# EasyEDA Pro project ProPrj_Motorcycle Controller_2026-08-31.epro

# Schematic Moto-Ctrl
Board Name: Board1; Create Date: 2026-07-16; Page Name: P1; Project Name: Motorcycle Controller; Schematic Name: Schematic3; Update Date: 2026-07-16; Company: EasyEDA.com; Page Size: A4; Version: V0.1
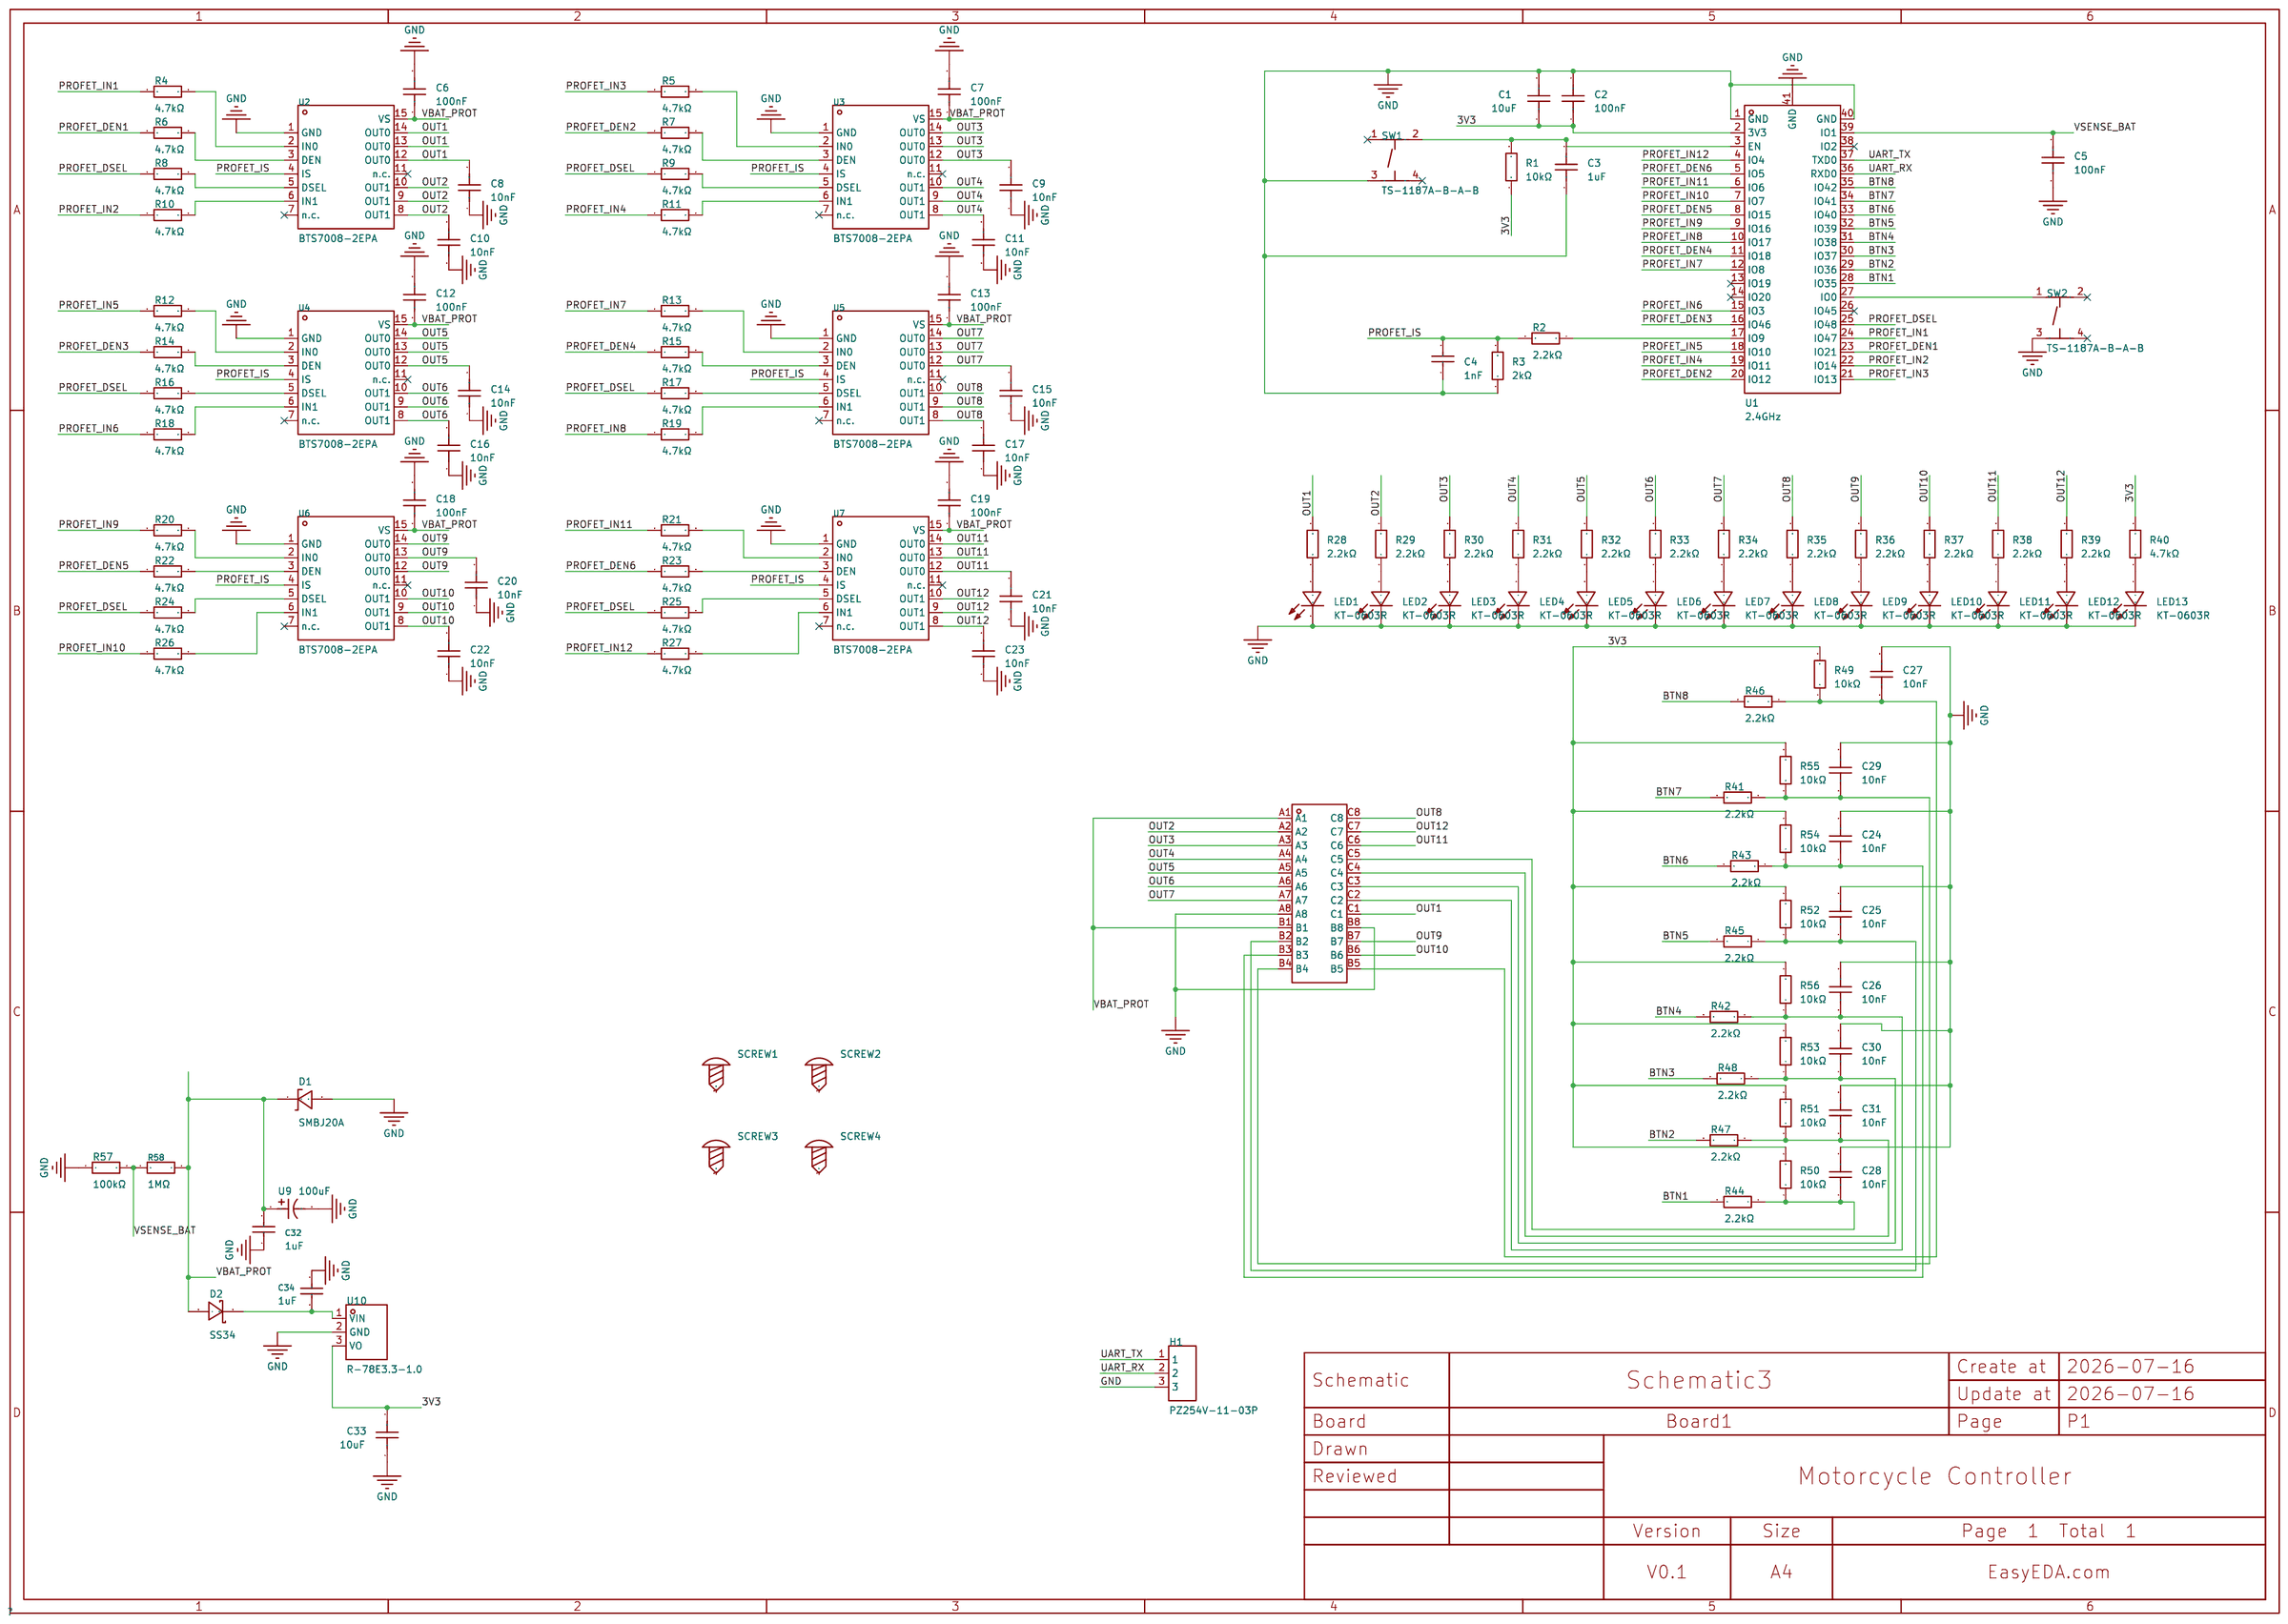
[diagram p0: schematic sheet]

## Parts
C1  10uF  [C0603]
C2  100nF  [C0402]
C3  1uF  [C0402]
C4  1nF  [C0402]
C5  100nF  [C0402]
C6  100nF  [C0603]
C7  100nF  [C0603]
C8  10nF  [C0603]
C9  10nF  [C0603]
C10  10nF  [C0603]
C11  10nF  [C0603]
C12  100nF  [C0603]
C13  100nF  [C0603]
C14  10nF  [C0603]
C15  10nF  [C0603]
C16  10nF  [C0603]
C17  10nF  [C0603]
C18  100nF  [C0603]
C19  100nF  [C0603]
C20  10nF  [C0603]
C21  10nF  [C0603]
C22  10nF  [C0603]
C23  10nF  [C0603]
C24  10nF  [C0603]
C25  10nF  [C0603]
C26  10nF  [C0603]
C27  10nF  [C0603]
C28  10nF  [C0603]
C29  10nF  [C0603]
C30  10nF  [C0603]
C31  10nF  [C0603]
C32  1uF  [C0805]
C33  10uF  [C0603]
C34  1uF  [C0805]
CN3  HCCPHPE24BKA90F  [CONN-TH_HCCPHPE24BKA90F]
D1  SMBJ20A  [SMB_L4.6-W3.6-LS5.3-RD]
D2  SS34  [SMA_L4.3-W2.6-LS5.2-RD]
H1  PZ254V-11-03P  [HDR-TH_3P-P2.54-V-M_PZ254V-11-03P]
LED1  KT-0603R  [LED-SMD_L1.6-W0.8-R-RD]
LED2  KT-0603R  [LED-SMD_L1.6-W0.8-R-RD]
LED3  KT-0603R  [LED-SMD_L1.6-W0.8-R-RD]
LED4  KT-0603R  [LED-SMD_L1.6-W0.8-R-RD]
LED5  KT-0603R  [LED-SMD_L1.6-W0.8-R-RD]
LED6  KT-0603R  [LED-SMD_L1.6-W0.8-R-RD]
LED7  KT-0603R  [LED-SMD_L1.6-W0.8-R-RD]
LED8  KT-0603R  [LED-SMD_L1.6-W0.8-R-RD]
LED9  KT-0603R  [LED-SMD_L1.6-W0.8-R-RD]
LED10  KT-0603R  [LED-SMD_L1.6-W0.8-R-RD]
LED11  KT-0603R  [LED-SMD_L1.6-W0.8-R-RD]
LED12  KT-0603R  [LED-SMD_L1.6-W0.8-R-RD]
LED13  KT-0603R  [LED-SMD_L1.6-W0.8-R-RD]
R1  10kΩ  [R0402]
R2  2.2kΩ  [R0603]
R3  2kΩ  [R0603]
R4  4.7kΩ  [R0603]
R5  4.7kΩ  [R0603]
R6  4.7kΩ  [R0603]
R7  4.7kΩ  [R0603]
R8  4.7kΩ  [R0603]
R9  4.7kΩ  [R0603]
R10  4.7kΩ  [R0603]
R11  4.7kΩ  [R0603]
R12  4.7kΩ  [R0603]
R13  4.7kΩ  [R0603]
R14  4.7kΩ  [R0603]
R15  4.7kΩ  [R0603]
R16  4.7kΩ  [R0603]
R17  4.7kΩ  [R0603]
R18  4.7kΩ  [R0603]
R19  4.7kΩ  [R0603]
R20  4.7kΩ  [R0603]
R21  4.7kΩ  [R0603]
R22  4.7kΩ  [R0603]
R23  4.7kΩ  [R0603]
R24  4.7kΩ  [R0603]
R25  4.7kΩ  [R0603]
R26  4.7kΩ  [R0603]
R27  4.7kΩ  [R0603]
R28  2.2kΩ  [R0603]
R29  2.2kΩ  [R0603]
R30  2.2kΩ  [R0603]
R31  2.2kΩ  [R0603]
R32  2.2kΩ  [R0603]
R33  2.2kΩ  [R0603]
R34  2.2kΩ  [R0603]
R35  2.2kΩ  [R0603]
R36  2.2kΩ  [R0603]
R37  2.2kΩ  [R0603]
R38  2.2kΩ  [R0603]
R39  2.2kΩ  [R0603]
R40  4.7kΩ  [R0603]
R41  2.2kΩ  [R0603]
R42  2.2kΩ  [R0603]
R43  2.2kΩ  [R0603]
R44  2.2kΩ  [R0603]
R45  2.2kΩ  [R0603]
R46  2.2kΩ  [R0603]
R47  2.2kΩ  [R0603]
R48  2.2kΩ  [R0603]
R49  10kΩ  [R0402]
R50  10kΩ  [R0402]
R51  10kΩ  [R0402]
R52  10kΩ  [R0402]
R53  10kΩ  [R0402]
R54  10kΩ  [R0402]
R55  10kΩ  [R0402]
R56  10kΩ  [R0402]
R57  100kΩ  [R0603]
R58  1MΩ  [R0603]
SCREW1  -  [Screw-Hole-M3]
SCREW2  -  [Screw-Hole-M3]
SCREW3  -  [Screw-Hole-M3]
SCREW4  -  [Screw-Hole-M3]
SW1  TS-1187A-B-A-B  [SW-SMD_4P-L5.1-W5.1-P3.70-LS6.5-TL_H1.5]
SW2  TS-1187A-B-A-B  [SW-SMD_4P-L5.1-W5.1-P3.70-LS6.5-TL_H1.5]
U1  2.4GHz  [WIFIM-SMD_ESP32-S3-WROOM-1-N8]
U2  BTS7008-2EPA  [PG-TSDSO-14_L4.9-W3.9-P0.65-LS6.0-BL-EP]
U3  BTS7008-2EPA  [PG-TSDSO-14_L4.9-W3.9-P0.65-LS6.0-BL-EP]
U4  BTS7008-2EPA  [PG-TSDSO-14_L4.9-W3.9-P0.65-LS6.0-BL-EP]
U5  BTS7008-2EPA  [PG-TSDSO-14_L4.9-W3.9-P0.65-LS6.0-BL-EP]
U6  BTS7008-2EPA  [PG-TSDSO-14_L4.9-W3.9-P0.65-LS6.0-BL-EP]
U7  BTS7008-2EPA  [PG-TSDSO-14_L4.9-W3.9-P0.65-LS6.0-BL-EP]
U9  100uF  [CAP-SMD_BD8.0-L8.3-W8.3-LS9.1-FD]
U10  R-78E3.3-1.0  [PWRM-TH_R-78EXX-1.0]

## Library data of the parts
C1 C33 = CL10A106KP8NNNC: Capacitance:10uF Tolerance:±10% Tolerance:±10% Voltage Rating:10V Temperature Coefficient:X5R; LCSC Part Name: 10uF ±10% 10V; Supplier Part: C19702; Manufacturer: SAMSUNG(三星); Supplier Footprint: 0603; JLCPCB Part Class: Basic Part; Datasheet: https://item.szlcsc.com/datasheet/CL10A106KP8NNNC/20411.html; Supplier: LCSC; Tolerance: ±10%; Voltage Rating: 10V; Temperature Coefficient: X5R
C2 C5 = CL05B104KO5NNNC: Capacitance:100nF Tolerance:±10% Tolerance:±10% Voltage Rating:16V Temperature Coefficient:X7R; LCSC Part Name: 100nF ±10% 16V; Supplier Part: C1525; Manufacturer: SAMSUNG(三星); Supplier Footprint: 0402; JLCPCB Part Class: Basic Part; Datasheet: https://item.szlcsc.com/datasheet/CL05B104KO5NNNC/1877.html; Supplier: LCSC; Tolerance: ±10%; Voltage Rating: 16V; Temperature Coefficient: X7R
C3 = CL05A105KA5NQNC: Capacitance:1uF Tolerance:±10% Tolerance:±10% Voltage Rating:25V Temperature Coefficient:X5R; LCSC Part Name: 1uF ±10% 25V; Supplier Part: C52923; Manufacturer: SAMSUNG(三星); Supplier Footprint: 0402; JLCPCB Part Class: Basic Part; Datasheet: https://item.szlcsc.com/datasheet/CL05A105KA5NQNC/53938.html; Supplier: LCSC; Tolerance: ±10%; Voltage Rating: 25V; Temperature Coefficient: X5R
C4 = 0402B102K500NT: Capacitance:1nF Tolerance:±10% Tolerance:±10% Voltage Rating:50V Temperature Coefficient:X7R; LCSC Part Name: 1nF ±10% 50V; Supplier Part: C1523; Manufacturer: FH(风华); Supplier Footprint: 0402; JLCPCB Part Class: Basic Part; Datasheet: https://item.szlcsc.com/datasheet/0402B102K500NT/1875.html; Supplier: LCSC; Tolerance: ±10%; Voltage Rating: 50V; Temperature Coefficient: X7R
C6 C7 C12 C13 C18 C19 = CC0603KRX7R9BB104: Capacitance:100nF Tolerance:±10% Tolerance:±10% Voltage Rating:50V Temperature Coefficient:X7R; LCSC Part Name: 100nF ±10% 50V; Supplier Part: C14663; Manufacturer: YAGEO(国巨); Supplier Footprint: 0603; JLCPCB Part Class: Basic Part; Datasheet: https://item.szlcsc.com/datasheet/CC0603KRX7R9BB104/15331.html; Supplier: LCSC; Tolerance: ±10%; Voltage Rating: 50V; Temperature Coefficient: X7R
C8-C11 C14-C17 C20-C31 = 0603B103K500NT: Capacitance:10nF Tolerance:±10% Tolerance:±10% Voltage Rating:50V Temperature Coefficient:X7R; LCSC Part Name: 10nF ±10% 50V; Supplier Part: C57112; Manufacturer: FH(风华); Supplier Footprint: 0603; JLCPCB Part Class: Basic Part; Datasheet: https://item.szlcsc.com/datasheet/0603B103K500NT/58143.html; Supplier: LCSC; Tolerance: ±10%; Voltage Rating: 50V; Temperature Coefficient: X7R
C32 C34 = CL21B105KBFNNNE: Capacitance:1uF Tolerance:±10% Tolerance:±10% Voltage Rating:50V Temperature Coefficient:X7R; LCSC Part Name: 1uF ±10% 50V; Supplier Part: C28323; Manufacturer: SAMSUNG(三星); Supplier Footprint: 0805; JLCPCB Part Class: Basic Part; Datasheet: https://item.szlcsc.com/datasheet/CL21B105KBFNNNE/29074.html; Supplier: LCSC; Tolerance: ±10%; Voltage Rating: 50V; Temperature Coefficient: X7R
CN3 = HCCPHPE24BKA90F_C5349068: Supplier Part: C5349068; Manufacturer: Aptiv(Delphi); Supplier Footprint: 弯插; JLCPCB Part Class: Extended Part; Datasheet: https://item.szlcsc.com/datasheet/HCCPHPE24BKA90F/6133049.html; Supplier: LCSC
D1 = SMBJ20A_C364296: polarity:Bidirectional Reverse Stand-Off Voltage (Vrwm):20V Maximum Clamping Voltage:32.4V Peak Pulse Current (Ipp):18.6A Peak Pulse Power Dissipation (Ppp):600W Breakdown Voltage:24.5V Reverse Leakage Current (Ir):1uA Operating Temperature:-65℃~+150℃ Ope; LCSC Part Name: 单向TVS 20V截止 18.6A峰值脉冲; Supplier Part: C364296; Manufacturer: MDD(辰达半导体); Supplier Footprint: DO-214AA(SMB); JLCPCB Part Class: Extended Part; Datasheet: https://atta.szlcsc.com/upload/public/pdf/source/20240729/4651DBAA3EEC8A2972CE75AE0A6D3452.pdf; Supplier: LCSC; polarity: Bidirectional; Reverse Stand-Off Voltage (Vrwm): 20V; Maximum Clamping Voltage: 32.4V; Peak Pulse Current (Ipp): 18.6A; Peak Pulse Power Dissipation (Ppp): 600W; Breakdown Voltage: 24.5V; Reverse Leakage Current (Ir): 1uA; Operating Temperature: -65℃~+150℃; Type: TVS
D2 = SS34_C8678: Diode Configuration:Independent Voltage - Forward(Vf@If):550mV@3A Voltage - DC Reverse(Vr):40V Current - Rectified:3A Reverse Leakage Current (Ir):500uA@40V Operating Junction Temperature Range:-55℃~+125℃ Operating Junction Temperature Range:-55℃~+125℃; LCSC Part Name: 电压:40V 电流:3A; Supplier Part: C8678; Manufacturer: MDD(辰达半导体); Supplier Footprint: SMA(DO-214AC); JLCPCB Part Class: Basic Part; Datasheet: https://item.szlcsc.com/datasheet/SS34/9178.html; Supplier: LCSC; Diode Configuration: Independent; Voltage - Forward(Vf@If): 550mV@3A; Voltage - DC Reverse(Vr): 40V; Current - Rectified: 3A; Reverse Leakage Current (Ir): 500uA@40V; Operating Junction Temperature Range: -55℃~+125℃
H1 = PZ254V-11-03P: Pin Structure:1x3P Pitch:2.54mm Row Spacing:- Circluar Pins/Square Pins:Pin Header Mounting Type:Through Hole Number of Rows:1 Number of Pins:3P Current Rating:3A Voltage Rating (Max):250V Length of Mating Pin:6mm Insulation Height:2.5mm Length of End Con; LCSC Part Name: 1x3P 间距:2.54mm 方针 直插; Supplier Part: C2937625; Manufacturer: XFCN(兴飞); Supplier Footprint: 插件,P=2.54mm; JLCPCB Part Class: Extended Part; Datasheet: https://item.szlcsc.com/datasheet/PZ254V-11-03P/3293280.html; Supplier: LCSC; Pin Structure: 1x3P; Pitch: 2.54mm; Circluar Pins/Square Pins: Pin Header; Mounting Type: Through Hole; Number of Rows: 1; Number of Pins: 3P; Current Rating: 3A; Voltage Rating (Max): 250V; Length of Mating Pin: 6mm; Insulation Height: 2.5mm; Length of End Connection Pin: 3mm; Operating Temperature: -40℃~+105℃; Color: Black
LED1-LED13 = KT-0603R: Lamp Holder Type:1.6mm x 0.8mm square LED Illumination Color:Red Voltage - Forward(Vf):1.8V~2.4V Voltage - Forward(Vf):1.8V~2.4V Power(Watts):40mW Forward Current:20mA Wavelength - Dominant:615nm~630nm Wavelength - Dominant:615nm~630nm Peak Wavelength:645; LCSC Part Name: 0603 红灯 高亮; Supplier Part: C2286; Manufacturer: KENTO; Supplier Footprint: 0603; JLCPCB Part Class: Basic Part; Datasheet: https://item.szlcsc.com/datasheet/KT-0603R/2659.html; Supplier: LCSC; Lamp Holder Type: 1.6mm x 0.8mm square LED; Illumination Color: Red; Voltage - Forward(Vf): 1.8V~2.4V; Power(Watts): 40mW; Forward Current: 20mA; Wavelength - Dominant: 615nm~630nm; Peak Wavelength: 645nm; Diode Configuration: Discrete Diode; Lens Color: Water Clear; Luminous Intensity: 300mcd; Viewing Angle: 120°; Operating Temperature: -40℃~+85℃
R1 R49-R56 = RC0402FR-0710KL: Type:Thick Film Resistor Resistance:10kΩ Tolerance:±1% Tolerance:±1% Power(Watts):62.5mW Voltage-Supply(Max):50V Temperature Coefficient:±100ppm/℃ Temperature Coefficient:±100ppm/℃ Operating Temperature:-55℃~+155℃ Operating Temperature:-55℃~+155℃; LCSC Part Name: 厚膜电阻 10kΩ ±1% 62.5mW; Supplier Part: C60490; Manufacturer: YAGEO(国巨); Supplier Footprint: 0402; JLCPCB Part Class: Extended Part; Datasheet: https://item.szlcsc.com/datasheet/RC0402FR-0710KL/61542.html; Supplier: LCSC; Type: Thick Film Resistor; Tolerance: ±1%; Power(Watts): 62.5mW; Voltage-Supply(Max): 50V; Temperature Coefficient: ±100ppm/℃; Operating Temperature: -55℃~+155℃
R2 R28-R39 R41-R48 = 0603WAF2201T5E_C4190: Type:Thick Film Resistors Resistance:2.2kΩ Tolerance:±1% Tolerance:±1% Power(Watts): Overload Voltage (Max): Temperature Coefficient:±100ppm/℃ Temperature Coefficient:±100ppm/℃ Operating Temperature Range:-55℃~+155℃ Operating Temperature Range:-55℃~+155℃; LCSC Part Name: 2.2kΩ ±1% 100mW 厚膜电阻; Supplier Part: C4190; Manufacturer: UNI-ROYAL(厚声); Manufacturer Part: 0603WAF2201T5E; Supplier Footprint: 0603; JLCPCB Part Class: Basic Part; Datasheet: https://atta.szlcsc.com/upload/public/pdf/source/20200306/C422600_1E6D84923E4A46A82E41ADD87F860B5C.pdf; Supplier: LCSC; Type: Thick Film Resistors; Tolerance: ±1%; Temperature Coefficient: ±100ppm/℃; Operating Temperature Range: -55℃~+155℃
R3 = 0603WAF2001T5E: Type:Thick Film Resistor Resistance:2kΩ Tolerance:±1% Tolerance:±1% Power(Watts):100mW Voltage-Supply(Max):75V Temperature Coefficient:±100ppm/℃ Temperature Coefficient:±100ppm/℃ Operating Temperature:-55℃~+155℃ Operating Temperature:-55℃~+155℃; LCSC Part Name: 2kΩ ±1% 100mW 厚膜电阻; Supplier Part: C22975; Manufacturer: UNI-ROYAL(厚声); Supplier Footprint: 0603; JLCPCB Part Class: Basic Part; Datasheet: https://item.szlcsc.com/datasheet/0603WAF2001T5E/23702.html; Supplier: LCSC; Type: Thick Film Resistor; Tolerance: ±1%; Power(Watts): 100mW; Voltage-Supply(Max): 75V; Temperature Coefficient: ±100ppm/℃; Operating Temperature: -55℃~+155℃
R4-R27 R40 = 0603WAF4701T5E: Type:Thick Film Resistor Resistance:4.7kΩ Tolerance:±1% Tolerance:±1% Power(Watts):100mW Voltage-Supply(Max):75V Temperature Coefficient:±100ppm/℃ Temperature Coefficient:±100ppm/℃ Operating Temperature:-55℃~+155℃ Operating Temperature:-55℃~+155℃; LCSC Part Name: 4.7kΩ ±1% 100mW 厚膜电阻; Supplier Part: C23162; Manufacturer: UNI-ROYAL(厚声); Supplier Footprint: 0603; JLCPCB Part Class: Basic Part; Datasheet: https://item.szlcsc.com/datasheet/0603WAF4701T5E/23889.html; Supplier: LCSC; Type: Thick Film Resistor; Tolerance: ±1%; Power(Watts): 100mW; Voltage-Supply(Max): 75V; Temperature Coefficient: ±100ppm/℃; Operating Temperature: -55℃~+155℃
R57 = 0603WAF1003T5E: Type:Thick Film Resistor Resistance:100kΩ Tolerance:±1% Tolerance:±1% Power(Watts):100mW Voltage-Supply(Max):75V Temperature Coefficient:±100ppm/℃ Temperature Coefficient:±100ppm/℃ Operating Temperature:-55℃~+155℃ Operating Temperature:-55℃~+155℃; LCSC Part Name: 100kΩ ±1% 100mW 厚膜电阻; Supplier Part: C25803; Manufacturer: UNI-ROYAL(厚声); Supplier Footprint: 0603; JLCPCB Part Class: Basic Part; Datasheet: https://item.szlcsc.com/datasheet/0603WAF1003T5E/26546.html; Supplier: LCSC; Type: Thick Film Resistor; Tolerance: ±1%; Power(Watts): 100mW; Voltage-Supply(Max): 75V; Temperature Coefficient: ±100ppm/℃; Operating Temperature: -55℃~+155℃
R58 = 0603WAF1004T5E: Type:Thick Film Resistor Resistance:1MΩ Tolerance:±1% Tolerance:±1% Power(Watts):100mW Voltage-Supply(Max):75V Temperature Coefficient:±100ppm/℃ Temperature Coefficient:±100ppm/℃ Operating Temperature:-55℃~+155℃ Operating Temperature:-55℃~+155℃; LCSC Part Name: 1MΩ ±1% 100mW 厚膜电阻; Supplier Part: C22935; Manufacturer: UNI-ROYAL(厚声); Supplier Footprint: 0603; JLCPCB Part Class: Basic Part; Datasheet: https://item.szlcsc.com/datasheet/0603WAF1004T5E/23662.html; Supplier: LCSC; Type: Thick Film Resistor; Tolerance: ±1%; Power(Watts): 100mW; Voltage-Supply(Max): 75V; Temperature Coefficient: ±100ppm/℃; Operating Temperature: -55℃~+155℃
SCREW1-SCREW4 = Screw-Hole-M3: Supplier Footprint: 插件
SW1 SW2 = TS-1187A-B-A-B: Circuit:SPST Actuator Style:Round Button Operating Force:1.6N Mounting Type:Surface Mount,Vertical Length:5.1mm Width:5.1mm Switch Height:1.5mm with Bracket:Without Bracket Contact Current:50mA Voltage Rating:12V Actuator/Cap Color:Gold With Lamp:No Life:; LCSC Part Name: 5.1*5.1*1.5mm 立贴 轻触开关; Supplier Part: C318884; Manufacturer: XKB Connection(中国星坤); Supplier Footprint: SMD; JLCPCB Part Class: Basic Part; Datasheet: https://item.szlcsc.com/datasheet/TS-1187A-B-A-B/299976.html; Supplier: LCSC; Circuit: SPST; Actuator Style: Round Button; Operating Force: 1.6N; Mounting Type: Surface Mount,Vertical; Length: 5.1mm; Width: 5.1mm; Switch Height: 1.5mm; with Bracket: Without Bracket; Contact Current: 50mA; Voltage Rating: 12V; Actuator/Cap Color: Gold; With Lamp: No; Life: 100,000 Cycles; Operating Temperature: -30℃~+85℃
U1 = ESP32-S3-WROOM-1-N4: Utilized IC / Part:ESP32-S3 Wireless Standard:Bluetooth5.0 Interface Type:I2C；GPIO；UART；SPI；USB；I2S Frequency:2.4GHz Antenna Type:On-board PCB Antenna Output Power:20.5dBm Output Power:20.5dBm Voltage - Supply:3V~3.6V Voltage - Supply:3V~3.6V Receive  Cur; LCSC Part Name: 不带固件 通用型Wi-Fi+低功耗蓝牙MCU模组; Supplier Part: C2913197; Manufacturer: ESPRESSIF(乐鑫); Supplier Footprint: SMD,25.5x18mm; JLCPCB Part Class: Extended Part; Datasheet: https://item.szlcsc.com/datasheet/ESP32-S3-WROOM-1-N4/3198295.html; Supplier: LCSC; Utilized IC / Part: ESP32-S3; Wireless Standard: Bluetooth5.0; Interface Type: I2C；GPIO；UART；SPI；USB；I2S; Antenna Type: On-board PCB Antenna; Output Power: 20.5dBm; Voltage - Supply: 3V~3.6V; Receive  Current: 95mA; Send  Current: 355mA; Sensitivity: -103.5dBm; Operating Temperature: -40℃~+85℃
U2-U7 = BTS7008-2EPA: Type:High Side Switch Number of Channels:2 Control Input Logic:Active High Voltage - Supply:3.1V~28V Voltage - Supply:3.1V~28V Maximum Continuous Current:7.5A RDS(on):16mΩ Features:Overvoltage protection；Over temperature protection；Overcurrent Protection；; LCSC Part Name: 12V 2x 8mΩ 智能高端功率开关; Supplier Part: C534830; Manufacturer: Infineon(英飞凌); Supplier Footprint: TSDSO-14; JLCPCB Part Class: Extended Part; Datasheet: https://item.szlcsc.com/datasheet/BTS7008-2EPA/555214.html; Supplier: LCSC; Type: High Side Switch; Number of Channels: 2; Control Input Logic: Active High; Voltage - Supply: 3.1V~28V; Maximum Continuous Current: 7.5A; RDS(on): 16mΩ; Features: Overvoltage protection；Over temperature protection；Overcurrent Protection；Short-Circuit  Protection；Reverse voltage protection；Latch protection；Under-voltage lockout; Operating Temperature	-: -40℃~+150℃
U9 = RVT1H101M0810 100UF 50V: Capacitance:100uF Tolerance:±20% Tolerance:±20% Voltage Rating:50V Ripple Current:146mA@120Hz Equivalent Series Resistance(ESR):- Diameter:8mm Height - Seated (Max):10.2mm Lifetime:2800hrs@105℃ Operating Temperature:-55℃~+105℃ Operating Temperature:-55℃~+; LCSC Part Name: 100uF ±20% 50V; Supplier Part: C970687; Manufacturer: DMBJ(振宝佳); Supplier Footprint: SMD,D8xL10.2mm; JLCPCB Part Class: Extended Part; Datasheet: https://item.szlcsc.com/datasheet/RVT1H101M0810%2520100UF%252050V/1060415.html; Supplier: LCSC; Tolerance: ±20%; Voltage Rating: 50V; Ripple Current: 146mA@120Hz; Diameter: 8mm; Height - Seated (Max): 10.2mm; Lifetime: 2800hrs@105℃; Operating Temperature: -55℃~+105℃
U10 = R-78E3.3-1.0: Type:- Function:Step-down type Number of Outputs:1 Voltage - Supply:6V~36V Voltage - Supply:6V~36V Conversion Efficiency:90% Conversion Efficiency:90% Output Voltage:3.3V Output Voltage:3.3V Output Voltage Accuracy:±3% Output Voltage Accuracy:±3% Output C; LCSC Part Name: DC/DC电源模块宽压输入非隔离稳压输出; Supplier Part: C22371889; Manufacturer: YLPTEC(易川); Supplier Footprint: SIP,11.6x7.5mm; JLCPCB Part Class: Extended Part; Datasheet: https://item.szlcsc.com/datasheet/R-78E3.3-1.0/23862551.html; Supplier: LCSC; Function: Step-down type; Number of Outputs: 1; Voltage - Supply: 6V~36V; Conversion Efficiency: 90%; Output Voltage: 3.3V; Output Voltage Accuracy: ±3%; Output Current(Max): 1A; Quiescent Supply Current: 300uA; Ripple Noise: 50mVp-p; Switching Frequency: 850kHz; Capacitive Load(Max): 2200uF; Operating Temperature Range: -40℃~+85℃; Length: 11.6mm; Width: 7.5mm; Height: 10.2mm; Features: Short Circuit Protection；Automatic fault recovery

## Nets
3V3: C1.1 C2.1 C33.2 R1.1 R40.2 R49.2 R50.2 R51.2 R52.2 R53.2 R54.2 R55.2 R56.2 U1.2(3V3) U10.3(VO)
GND: C1.2 C2.2 C3.1 C4.1 C5.1 C6.2 C7.2 C8.1 C9.1 C10.1 C11.1 C12.2 C13.2 C14.1 C15.1 C16.1 C17.1 C18.2 C19.2 C20.1 C21.1 C22.1 C23.1 C24.2 C25.2 C26.2 C27.2 C28.2 C29.2 C30.2 C31.2 C32.1 C33.1 C34.1 CN3.A8 CN3.B8 D1.2(A) H1.3 LED1.2(K) LED2.2(K) LED3.2(K) LED4.2(K) LED5.2(K) LED6.2(K) LED7.2(K) LED8.2(K) LED9.2(K) LED10.2(K) LED11.2(K) LED12.2(K) LED13.2(K) R3.1 R57.1 SW1.3(C) SW2.3(C) U1.1(GND) U1.40(GND) U1.41(GND) U2.1(GND) U3.1(GND) U4.1(GND) U5.1(GND) U6.1(GND) U7.1(GND) U9.2 U10.2(GND)
VBAT_PROT: C6.1 C7.1 C12.1 C13.1 C18.1 C19.1 C32.2 CN3.A1 CN3.B1 D1.1(K) D2.2(A) R58.2 U2.15(VS) U3.15(VS) U4.15(VS) U5.15(VS) U6.15(VS) U7.15(VS) U9.1
BTN1: R44.2 U1.28(IO35)
BTN2: R47.2 U1.29(IO36)
BTN3: R48.2 U1.30(IO37)
BTN4: R42.2 U1.31(IO38)
BTN5: R45.2 U1.32(IO39)
BTN6: R43.2 U1.33(IO40)
BTN7: R41.2 U1.34(IO41)
BTN8: R46.2 U1.35(IO42)
OUT1: C8.2 CN3.C1 R28.2 U2.12(OUT0) U2.13(OUT0) U2.14(OUT0)
OUT2: C10.2 CN3.A2 R29.2 U2.8(OUT1) U2.9(OUT1) U2.10(OUT1)
OUT3: C9.2 CN3.A3 R30.2 U3.12(OUT0) U3.13(OUT0) U3.14(OUT0)
OUT4: C11.2 CN3.A4 R31.2 U3.8(OUT1) U3.9(OUT1) U3.10(OUT1)
OUT5: C14.2 CN3.A5 R32.2 U4.12(OUT0) U4.13(OUT0) U4.14(OUT0)
OUT6: C16.2 CN3.A6 R33.2 U4.8(OUT1) U4.9(OUT1) U4.10(OUT1)
OUT7: C15.2 CN3.A7 R34.2 U5.12(OUT0) U5.13(OUT0) U5.14(OUT0)
OUT8: C17.2 CN3.C8 R35.2 U5.8(OUT1) U5.9(OUT1) U5.10(OUT1)
OUT9: C20.2 CN3.B7 R36.2 U6.12(OUT0) U6.13(OUT0) U6.14(OUT0)
OUT10: C22.2 CN3.B6 R37.2 U6.8(OUT1) U6.9(OUT1) U6.10(OUT1)
OUT11: C21.2 CN3.C6 R38.2 U7.12(OUT0) U7.13(OUT0) U7.14(OUT0)
OUT12: C23.2 CN3.C7 R39.2 U7.8(OUT1) U7.9(OUT1) U7.10(OUT1)
PROFET_DEN1: R6.1 U1.23(IO21)
PROFET_DEN2: R7.1 U1.20(IO12)
PROFET_DEN3: R14.1 U1.16(IO46)
PROFET_DEN4: R15.1 U1.11(IO18)
PROFET_DEN5: R22.1 U1.8(IO15)
PROFET_DEN6: R23.1 U1.5(IO5)
PROFET_DSEL: R8.1 R9.1 R16.1 R17.1 R24.1 R25.1 U1.25(IO48)
PROFET_IN1: R4.1 U1.24(IO47)
PROFET_IN2: R10.1 U1.22(IO14)
PROFET_IN3: R5.1 U1.21(IO13)
PROFET_IN4: R11.1 U1.19(IO11)
PROFET_IN5: R12.1 U1.18(IO10)
PROFET_IN6: R18.1 U1.15(IO3)
PROFET_IN7: R13.1 U1.12(IO8)
PROFET_IN8: R19.1 U1.10(IO17)
PROFET_IN9: R20.1 U1.9(IO16)
PROFET_IN10: R26.1 U1.7(IO7)
PROFET_IN11: R21.1 U1.6(IO6)
PROFET_IN12: R27.1 U1.4(IO4)
PROFET_IS: C4.2 R2.2 R3.2 U2.4(IS) U3.4(IS) U4.4(IS) U5.4(IS) U6.4(IS) U7.4(IS)
UART_RX: H1.2 U1.36(RXD0)
UART_TX: H1.1 U1.37(TXD0)
VSENSE_BAT: C5.2 R57.2 R58.1 U1.39(IO1)
$1N12: R2.1 U1.17(IO9)
$1N15: C3.2 R1.2 SW1.2(B) U1.3(EN)
$1N16: SW2.1(A) U1.27(IO0)
$1N105: R4.2 U2.2(IN0)
$1N106: R6.2 U2.3(DEN)
$1N107: R8.2 U2.5(DSEL)
$1N108: R10.2 U2.6(IN1)
$1N109: R12.2 U4.2(IN0)
$1N110: R14.2 U4.3(DEN)
$1N111: R16.2 U4.5(DSEL)
$1N112: R18.2 U4.6(IN1)
$1N113: R20.2 U6.2(IN0)
$1N114: R22.2 U6.3(DEN)
$1N115: R24.2 U6.5(DSEL)
$1N116: R26.2 U6.6(IN1)
$1N117: R5.2 U3.2(IN0)
$1N118: R7.2 U3.3(DEN)
$1N119: R9.2 U3.5(DSEL)
$1N120: R11.2 U3.6(IN1)
$1N121: R13.2 U5.2(IN0)
$1N122: R15.2 U5.3(DEN)
$1N123: R17.2 U5.5(DSEL)
$1N124: R19.2 U5.6(IN1)
$1N125: R21.2 U7.2(IN0)
$1N126: R23.2 U7.3(DEN)
$1N127: R25.2 U7.5(DSEL)
$1N128: R27.2 U7.6(IN1)
$1N191: LED1.1(A) R28.1
$1N192: LED2.1(A) R29.1
$1N193: LED3.1(A) R30.1
$1N194: LED4.1(A) R31.1
$1N195: LED5.1(A) R32.1
$1N196: LED6.1(A) R33.1
$1N197: LED7.1(A) R34.1
$1N198: LED8.1(A) R35.1
$1N199: LED9.1(A) R36.1
$1N200: LED10.1(A) R37.1
$1N201: LED11.1(A) R38.1
$1N202: LED12.1(A) R39.1
$1N205: LED13.1(A) R40.1
$1N232: C27.1 CN3.B5 R46.1 R49.1
$1N234: C28.1 CN3.C5 R44.1 R50.1
$1N241: C26.1 CN3.C2 R42.1 R56.1
$1N243: C25.1 CN3.B2 R45.1 R52.1
$1N245: C24.1 CN3.B3 R43.1 R54.1
$1N257: C34.2 D2.1(K) U10.1(VIN)
$1N268: C29.1 CN3.B4 R41.1 R55.1
$1N277: C30.1 CN3.C3 R48.1 R53.1
$1N278: C31.1 CN3.C4 R47.1 R51.1

Not connected (* = marked no-connect by the designer): SCREW1 1; SCREW2 1; SCREW3 1; SCREW4 1; SW1 1(A)* 4(D)*; SW2 2(B)* 4(D)*; U1 13(IO19)* 14(IO20)* 26(IO45)* 38(IO2)*; U2 7(n.c.)* 11(n.c.)*; U3 7(n.c.)* 11(n.c.)*; U4 7(n.c.)* 11(n.c.)*; U5 7(n.c.)* 11(n.c.)*; U6 7(n.c.)* 11(n.c.)*; U7 7(n.c.)* 11(n.c.)*

# Board PCB3
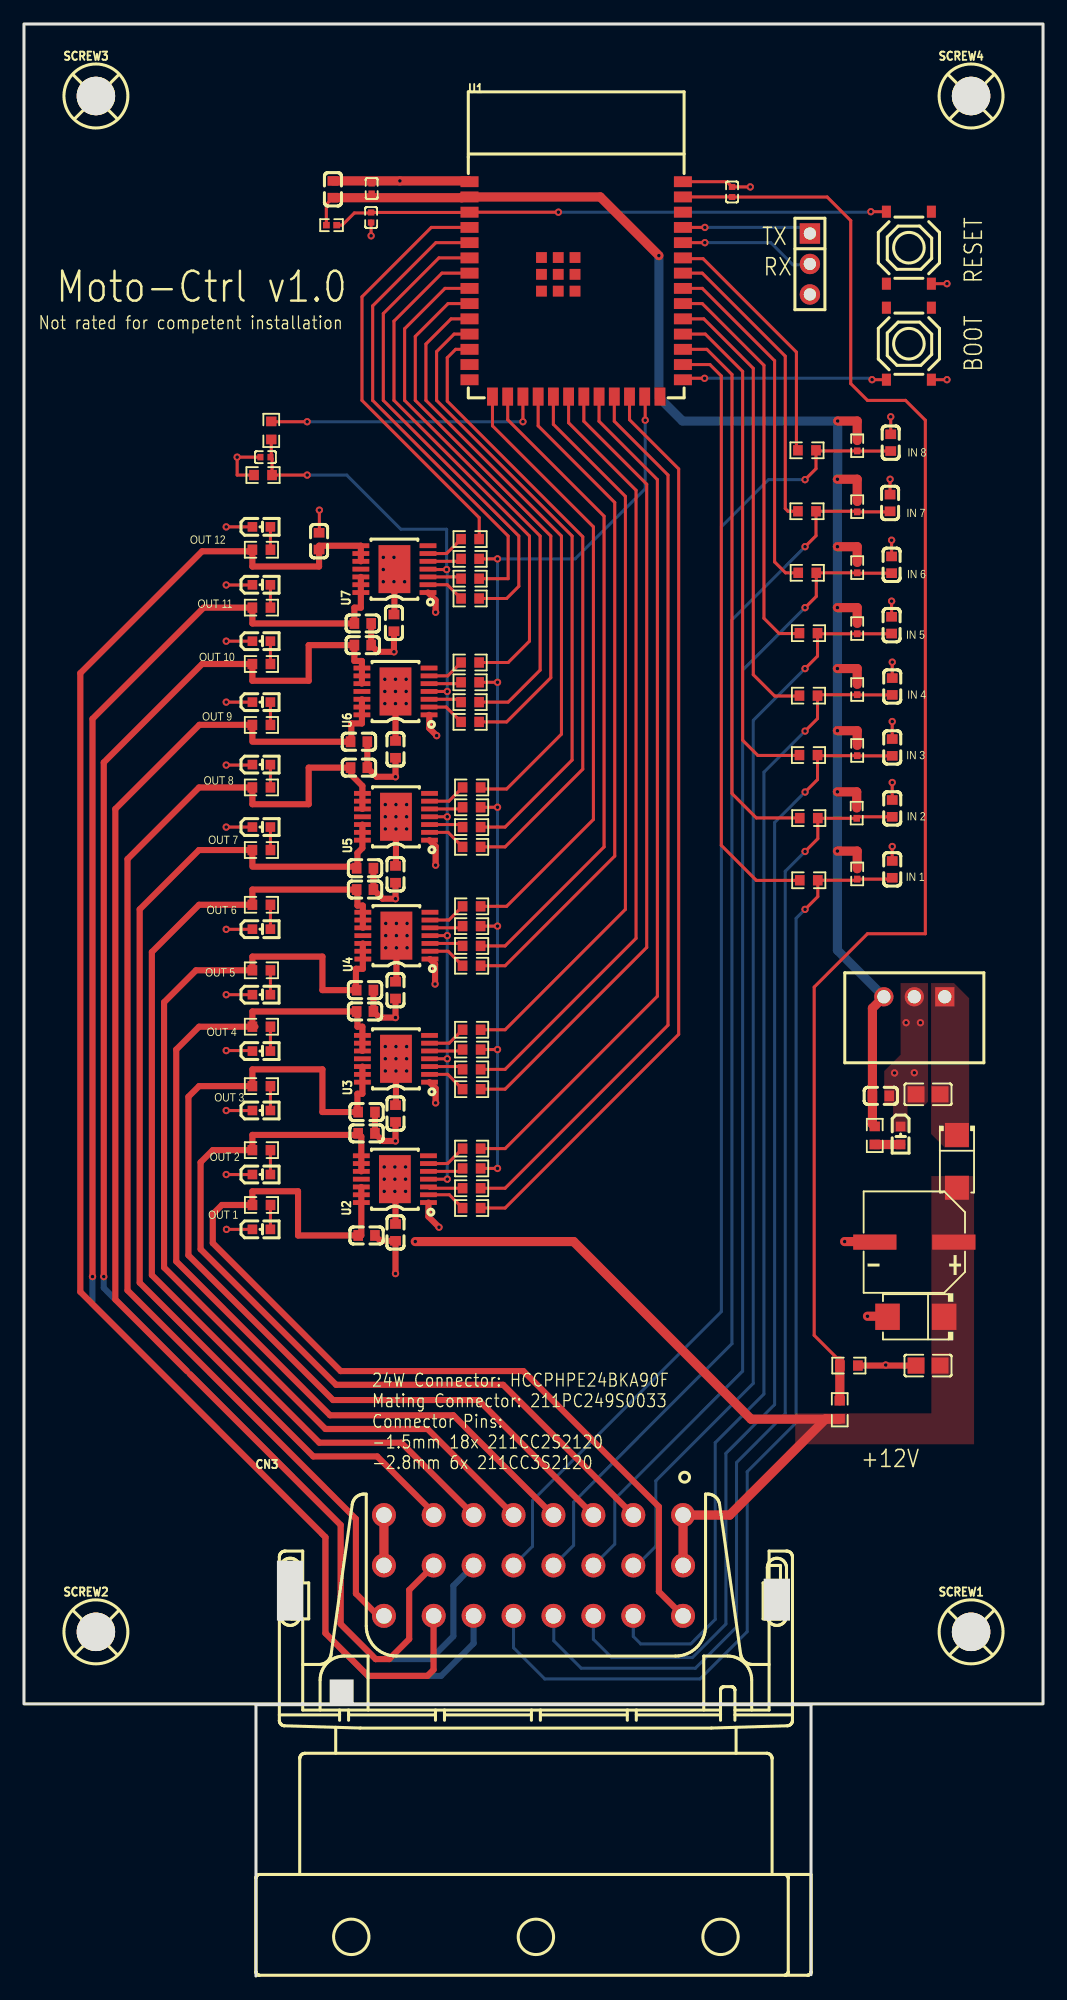
[diagram p1: board, top side]
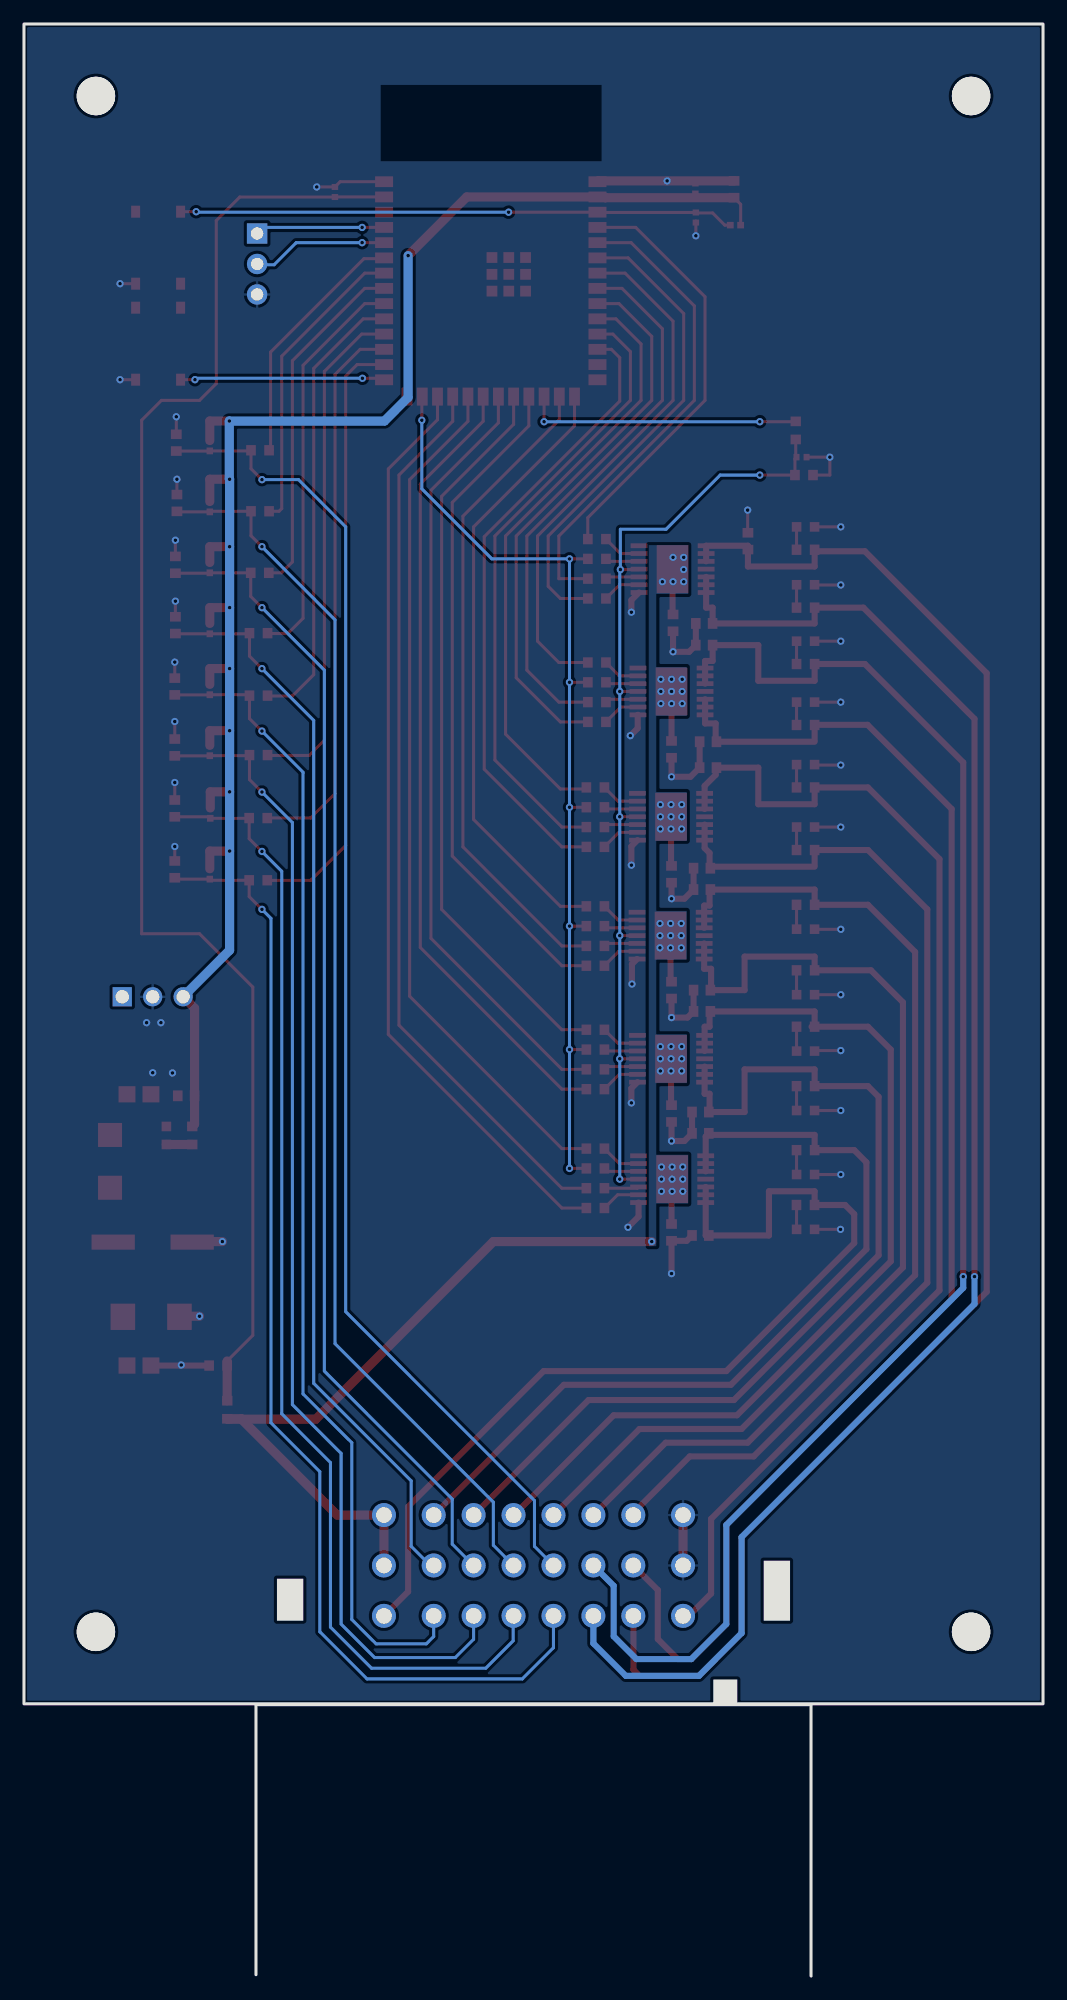
[diagram p2: board, bottom side, seen from below]

Outline 85 x 162.68 mm; copper layers: Top Layer, GND, +12V, Bottom Layer. Coordinates in mm from the lower left corner of the outline.
Outline path: rectangle 0,162.68 85,22.68
Stack: Top Layer 0.035mm Outer layer thickness 1oz / Dielectric1 0.2104mm 7628 RC49% 8.6mil / GND 0.0152mm Inner layer thickness / Dielectric2 1.065mm 1.1mm H/HOZ Copper / +12V 0.0152mm Inner layer thickness / Dielectric3 0.2104mm 7628 RC49% 8.6mil / Bottom Layer 0.035mm Outer layer thickness 1oz

## Design rules (mm)
spacing copperThickness1oz (default): track to track 0.102, other pairs 0.152 to 0.3
spacing copperThickness2oz: track to track 0.203, other pairs 0.152 to 0.3
track width copperThickness1oz (default): min 0.127, default 0.254, max 2.54
track width copperThickness2oz: min 0.203, default 0.254, max 2.54
differential pair differentialPair (default): width min 0.127, default 0.254, max 2.54; gap min 0.152, default 0.152
net GND uses copperRegion

## Placement (name value [footprint] x y rotation side)
C1  10uF  [C0603]  25.77 148.91 90 top
C2  100nF  [C0402]  29 148.97 90 top
C3  1uF  [C0402]  28.96 146.55 90 top
C4  1nF  [C0402]  20.14 126.58 0 top
C5  100nF  [C0402]  59.06 148.68 270 top
C6  100nF  [C0603]  30.86 112.77 270 top
C7  100nF  [C0603]  30.99 102.23 270 top
C8  10nF  [C0603]  28.57 61.72 180 top
C9  10nF  [C0603]  28.57 72 180 top
C10  10nF  [C0603]  28.57 70.23 180 top
C11  10nF  [C0603]  28.45 80.39 180 top
C12  100nF  [C0603]  30.99 91.82 270 top
C13  100nF  [C0603]  30.99 82.16 270 top
C14  10nF  [C0603]  28.45 82.16 180 top
C15  10nF  [C0603]  28.45 92.32 180 top
C16  10nF  [C0603]  28.45 90.55 180 top
C17  10nF  [C0603]  27.94 100.71 180 top
C18  100nF  [C0603]  30.99 71.88 270 top
C19  100nF  [C0603]  30.99 61.97 270 top
C20  10nF  [C0603]  27.94 102.87 180 top
C21  10nF  [C0603]  28.26 112.72 180 top
C22  10nF  [C0603]  28.26 110.92 180 top
C23  10nF  [C0603]  24.61 119.58 270 top
C24  10nF  [C0603]  72.37 117.61 90 top
C25  10nF  [C0603]  72.37 112.58 90 top
C26  10nF  [C0603]  72.42 107.47 90 top
C27  10nF  [C0603]  72.29 127.79 90 top
C28  10nF  [C0603]  72.42 92.23 90 top
C29  10nF  [C0603]  72.24 122.77 90 top
C30  10nF  [C0603]  72.42 102.39 90 top
C31  10nF  [C0603]  72.42 97.31 90 top
C32  1uF  [C0805]  75.41 50.88 0 top
C33  10uF  [C0603]  71.47 73.35 180 top
C34  1uF  [C0805]  75.41 73.48 0 top
CN3  HCCPHPE24BKA90F  [CONN-TH_HCCPHPE24BKA90F]  42.5 34.22 0 top
D1  SMBJ20A  [SMB_L4.6-W3.6-LS5.3-RD]  74.39 54.94 180 top
D2  SS34  [SMA_L4.3-W2.6-LS5.2-RD]  77.82 67.89 270 top
H1  PZ254V-11-03P  [HDR-TH_3P-P2.54-V-M_PZ254V-11-03P]  65.56 142.68 270 top
LED1  KT-0603R  [LED-SMD_L1.6-W0.8-R-RD]  19.81 62.23 0 top
LED2  KT-0603R  [LED-SMD_L1.6-W0.8-R-RD]  19.81 66.8 0 top
LED3  KT-0603R  [LED-SMD_L1.6-W0.8-R-RD]  19.81 72.13 0 top
LED4  KT-0603R  [LED-SMD_L1.6-W0.8-R-RD]  19.81 77.08 0 top
LED5  KT-0603R  [LED-SMD_L1.6-W0.8-R-RD]  19.81 81.78 0 top
LED6  KT-0603R  [LED-SMD_L1.6-W0.8-R-RD]  19.81 87.24 0 top
LED7  KT-0603R  [LED-SMD_L1.6-W0.8-R-RD]  19.81 95.75 0 top
LED8  KT-0603R  [LED-SMD_L1.6-W0.8-R-RD]  19.81 100.96 0 top
LED9  KT-0603R  [LED-SMD_L1.6-W0.8-R-RD]  19.81 106.17 0 top
LED10  KT-0603R  [LED-SMD_L1.6-W0.8-R-RD]  19.81 111.25 0 top
LED11  KT-0603R  [LED-SMD_L1.6-W0.8-R-RD]  19.81 115.95 0 top
LED12  KT-0603R  [LED-SMD_L1.6-W0.8-R-RD]  19.81 120.77 0 top
LED13  KT-0603R  [LED-SMD_L1.6-W0.8-R-RD]  73.12 70.05 270 top
R1  10kΩ  [R0402]  25.65 145.92 0 top
R2  2.2kΩ  [R0603]  20.63 128.81 270 top
R3  2kΩ  [R0603]  19.94 125.09 0 top
R4  4.7kΩ  [R0603]  37.34 64 180 top
R5  4.7kΩ  [R0603]  37.34 73.91 180 top
R6  4.7kΩ  [R0603]  37.34 65.65 180 top
R7  4.7kΩ  [R0603]  37.34 75.56 180 top
R8  4.7kΩ  [R0603]  37.34 67.31 180 top
R9  4.7kΩ  [R0603]  37.34 77.21 180 top
R10  4.7kΩ  [R0603]  37.34 68.96 180 top
R11  4.7kΩ  [R0603]  37.34 78.86 180 top
R12  4.7kΩ  [R0603]  37.34 84.2 180 top
R13  4.7kΩ  [R0603]  37.34 94.1 180 top
R14  4.7kΩ  [R0603]  37.34 85.85 180 top
R15  4.7kΩ  [R0603]  37.34 95.75 180 top
R16  4.7kΩ  [R0603]  37.34 87.5 180 top
R17  4.7kΩ  [R0603]  37.34 97.4 180 top
R18  4.7kΩ  [R0603]  37.34 89.15 180 top
R19  4.7kΩ  [R0603]  37.34 99.06 180 top
R20  4.7kΩ  [R0603]  37.21 104.52 180 top
R21  4.7kΩ  [R0603]  37.21 114.8 180 top
R22  4.7kΩ  [R0603]  37.21 106.17 180 top
R23  4.7kΩ  [R0603]  37.21 116.45 180 top
R24  4.7kΩ  [R0603]  37.21 107.82 180 top
R25  4.7kΩ  [R0603]  37.21 118.11 180 top
R26  4.7kΩ  [R0603]  37.21 109.47 180 top
R27  4.7kΩ  [R0603]  37.21 119.76 180 top
R28  2.2kΩ  [R0603]  19.81 64.26 180 top
R29  2.2kΩ  [R0603]  19.81 68.83 180 top
R30  2.2kΩ  [R0603]  19.81 74.16 180 top
R31  2.2kΩ  [R0603]  19.81 79.12 180 top
R32  2.2kΩ  [R0603]  19.81 83.82 180 top
R33  2.2kΩ  [R0603]  19.81 89.28 180 top
R34  2.2kΩ  [R0603]  19.81 93.84 180 top
R35  2.2kΩ  [R0603]  19.81 99.06 180 top
R36  2.2kΩ  [R0603]  19.81 104.26 180 top
R37  2.2kΩ  [R0603]  19.81 109.34 180 top
R38  2.2kΩ  [R0603]  19.81 114.04 180 top
R39  2.2kΩ  [R0603]  19.81 118.87 180 top
R40  4.7kΩ  [R0603]  70.96 70.05 90 top
R41  2.2kΩ  [R0603]  65.31 122.07 180 top
R42  2.2kΩ  [R0603]  65.44 106.71 180 top
R43  2.2kΩ  [R0603]  65.33 116.94 180 top
R44  2.2kΩ  [R0603]  65.46 91.32 180 top
R45  2.2kΩ  [R0603]  65.44 111.91 180 top
R46  2.2kΩ  [R0603]  65.31 127.15 180 top
R47  2.2kΩ  [R0603]  65.46 96.5 180 top
R48  2.2kΩ  [R0603]  65.44 101.75 180 top
R49  10kΩ  [R0402]  69.5 127.54 90 top
R50  10kΩ  [R0402]  69.5 91.85 90 top
R51  10kΩ  [R0402]  69.46 96.92 90 top
R52  10kΩ  [R0402]  69.5 112.3 90 top
R53  10kΩ  [R0402]  69.5 102.14 90 top
R54  10kΩ  [R0402]  69.5 117.38 90 top
R55  10kΩ  [R0402]  69.5 122.46 90 top
R56  10kΩ  [R0402]  69.5 107.22 90 top
R57  100kΩ  [R0603]  68.8 50.88 180 top
R58  1MΩ  [R0603]  68.04 47.19 270 top
SCREW1  -  [Screw-Hole-M3]  79.06 28.62 0 top
SCREW2  -  [Screw-Hole-M3]  6.06 28.62 0 top
SCREW3  -  [Screw-Hole-M3]  6.06 156.62 0 top
SCREW4  -  [Screw-Hole-M3]  79.06 156.62 0 top
SW1  TS-1187A-B-A-B  [SW-SMD_4P-L5.1-W5.1-P3.70-LS6.5-TL_H1.5]  73.81 144.04 90 top
SW2  TS-1187A-B-A-B  [SW-SMD_4P-L5.1-W5.1-P3.70-LS6.5-TL_H1.5]  73.81 136.04 90 top
U1  2.4GHz  [WIFIM-SMD_ESP32-S3-WROOM-1-N8]  46.06 140.58 0 top
U2  BTS7008-2EPA  [PG-TSDSO-14_L4.9-W3.9-P0.65-LS6.0-BL-EP]  30.94 66.41 90 top
U3  BTS7008-2EPA  [PG-TSDSO-14_L4.9-W3.9-P0.65-LS6.0-BL-EP]  31.03 76.44 90 top
U4  BTS7008-2EPA  [PG-TSDSO-14_L4.9-W3.9-P0.65-LS6.0-BL-EP]  31.06 86.71 90 top
U5  BTS7008-2EPA  [PG-TSDSO-14_L4.9-W3.9-P0.65-LS6.0-BL-EP]  31.03 96.61 90 top
U6  BTS7008-2EPA  [PG-TSDSO-14_L4.9-W3.9-P0.65-LS6.0-BL-EP]  30.99 107.06 90 top
U7  BTS7008-2EPA  [PG-TSDSO-14_L4.9-W3.9-P0.65-LS6.0-BL-EP]  30.9 117.25 90 top
U9  100uF  [CAP-SMD_BD8.0-L8.3-W8.3-LS9.1-FD]  74.26 61.16 180 top
U10  R-78E3.3-1.0  [PWRM-TH_R-78EXX-1.0]  74.26 81.61 180 top

## Footprints (pads in the part's own frame, mm; a bottom-side part is the same pattern mirrored in y, then rotated)
C0402
  rect 0.5x0.54 smd: 1(-0.42,0) 2(0.42,0)
C0603
  rect 0.8x0.9 smd: 1(-0.7,0) 2(0.7,0)
C0805
  rect 1.41x1.35 smd: 1(-1,0) 2(1,0)
CAP-SMD_BD8.0-L8.3-W8.3-LS9.1-FD
  rect 3.61x1.26 smd: 1(-3.295,0) 2(3.295,0)
CONN-TH_HCCPHPE24BKA90F
  round 2 hole 1.3: A1(12.475,4.2) A2(8.325,4.2) A3(4.995,4.2) A4(1.665,4.2) A5(-1.665,4.2) A6(-4.995,4.2) A7(-8.325,4.2) A8(-12.475,4.2) B1(12.475,0) B2(8.325,0) B3(4.995,0) B4(1.665,0) B5(-1.665,0) B6(-4.995,0) B7(-8.325,0) B8(-12.475,0) C1(12.475,-4.2) C2(8.325,-4.2) C3(4.995,-4.2) C4(1.665,-4.2) C5(-1.665,-4.2) C6(-4.995,-4.2) C7(-8.325,-4.2) C8(-12.475,-4.2)
HDR-TH_3P-P2.54-V-M_PZ254V-11-03P
  rect 1.7x1.7 hole 1.02: 1(-2.54,0)
  round 1.7 hole 1.02: 2(0,0) 3(2.54,0)
LED-SMD_L1.6-W0.8-R-RD
  rect 0.8x0.8 smd: 1(0.75,0) 2(-0.75,0)
PG-TSDSO-14_L4.9-W3.9-P0.65-LS6.0-BL-EP
  rect 0.4x1.4 smd: 1(-1.95,-2.8) 2(-1.3,-2.8) 3(-0.65,-2.8) 4(0,-2.8) 5(0.65,-2.8) 6(1.3,-2.8) 7(1.95,-2.8) 8(1.95,2.8) 9(1.3,2.8) 10(0.65,2.8) 11(0,2.8) 12(-0.65,2.8) 13(-1.3,2.8) 14(-1.95,2.8)
  rect 4x2.65 smd: 15(0,0)
PWRM-TH_R-78EXX-1.0
  rect 1.6x1.6 hole 1.1: 1(-2.54,0)
  round 1.6 hole 1.1: 2(0,0) 3(2.54,0)
R0402
  rect 0.566x0.54 smd: 1(-0.433,0) 2(0.433,0)
R0603
  rect 0.806x0.864 smd: 1(-0.753,0) 2(0.753,0)
Screw-Hole-M3
  round 3.2 hole 3.2: 1(-0.064,0.064)
SMA_L4.3-W2.6-LS5.2-RD
  rect 2x2 smd: 1(-2.2,0) 2(2.2,0)
SMB_L4.6-W3.6-LS5.3-RD
  rect 2.047x2.192 smd: 1(-2.361,0) 2(2.361,0)
SW-SMD_4P-L5.1-W5.1-P3.70-LS6.5-TL_H1.5
  rect 1x0.75 smd: 1(-3,1.875) 2(3,1.875) 3(-3,-1.875) 4(3,-1.875)
WIFIM-SMD_ESP32-S3-WROOM-1-N8
  rect 1.5x0.9 smd: 1(-8.9,8.954) 2(-8.9,7.684) 3(-8.9,6.415) 4(-8.9,5.144) 5(-8.9,3.874) 6(-8.9,2.604) 7(-8.9,1.335) 8(-8.9,0.065) 9(-8.9,-1.206) 10(-8.9,-2.475) 11(-8.9,-3.745) 12(-8.9,-5.016) 13(-8.9,-6.285) 14(-8.9,-7.556) 27(8.9,-7.556) 28(8.9,-6.285) 29(8.9,-5.016) 30(8.9,-3.745) 31(8.9,-2.475) 32(8.9,-1.206) 33(8.9,0.065) 34(8.9,1.335) 35(8.9,2.604) 36(8.9,3.874) 37(8.9,5.144) 38(8.9,6.415) 39(8.9,7.684) 40(8.9,8.954)
  rect 0.9x1.5 smd: 15(-6.985,-8.954) 16(-5.715,-8.954) 17(-4.445,-8.954) 18(-3.175,-8.954) 19(-1.905,-8.954) 20(-0.635,-8.954) 21(0.635,-8.954) 22(1.905,-8.954) 23(3.175,-8.954) 24(4.445,-8.954) 25(5.715,-8.954) 26(6.985,-8.954)
  rect 0.9x0.9 smd: 41(-2.9,2.635) 41(-2.9,1.235) 41(-2.9,-0.165) 41(-1.5,2.635) 41(-1.5,1.235) 41(-1.5,-0.165) 41(-0.1,2.635) 41(-0.1,1.235) 41(-0.1,-0.165)

## Nets
As in the schematic.

Pads without a net: SCREW1 1; SCREW2 1; SCREW3 1; SCREW4 1; SW1 1 4; SW2 2 4; U1 13 14 26 38; U2 7 11; U3 7 11; U4 7 11; U5 7 11; U6 7 11; U7 7 11

## Via types
v1: diameter 0.61, hole 0.305, Top Layer to Bottom Layer, 139 vias

## Routing (per net, layer and track width the routed paths; a pad name or vN(x,y) marks a point on that pad's centre or on a via; arc(x,y) is an arc through that point)
3V3: length 144.2
  Top Layer w0.254: R1.1 25.22,147.66 C1.1
  Top Layer w0.762: R52.2 69.5,114.04 v1(67.85,114.04) ; v1(67.85,124.74) 69.5,124.74 R55.2 ; R40.2 70.77,71 C33.2 70.77,80.66 U10.3 ; C1.1 36.5,148.21 36.57,148.27 ; R49.2 69.5,129.59 v1(67.87,129.59) ; R51.2 69.46,98.69 v1(67.85,98.69) ; v1(67.85,108.96) 69.5,108.96 R56.2 ; v1(67.85,119.12) 69.5,119.12 R54.2 ; R53.2 69.5,103.79 v1(67.85,103.79) ; R50.2 69.5,93.75 v1(67.85,93.75) ; 37.16,148.27 48.07,148.27 v1(52.96,143.38)
  Bottom Layer w0.762: v1(52.96,143.38) 52.96,131.57 54.93,129.59 v1(67.87,129.59) 67.87,124.77 v1(67.85,124.74) v1(67.85,119.12) v1(67.85,114.04) v1(67.85,108.96) v1(67.85,103.79) v1(67.85,98.69) v1(67.85,93.75) 67.85,85.48 U10.3
GND: length 123.5
  Top Layer w0.254: v1(16.87,100.92) 19.01,100.92 LED8.2 ; LED3.2 v1(16.87,72.13) ; C24.2 v1(72.37,119.66) ; v1(60.58,149.1) C5.1 58.63,149.54 U1.40 ; SW2.3 v1(76.99,133.04) ; C23.1 24.64,120.28 v1(24.64,122.17) ; LED4.2 19.01,77.13 v1(16.87,77.13) ; LED9.2 v1(16.87,106.17) ; C28.2 v1(72.42,94.13) ; LED1.2 17.02,62.23 ; v1(16.87,115.93) 19.04,115.93 LED11.2 ; C29.2 v1(72.24,124.74) ; LED10.2 v1(16.87,111.25) ; C4.1 v1(17.78,126.58) 17.78,125.09 R3.1 ; C30.2 v1(72.42,104.55) ; C27.2 v1(72.29,129.95) ; LED7.2 v1(16.87,95.75) ; LED12.2 v1(16.87,120.77) ; C25.2 v1(72.37,114.58) ; LED5.2 v1(16.87,81.78) ; 28.96,146.26 v1(28.96,145.03) ; C31.2 v1(72.42,99.47) ; C26.2 v1(72.42,109.5) ; SW1.3 v1(76.99,141.04) ; LED2.2 v1(16.87,66.8) ; v1(16.87,87.23) 19.04,87.23 LED6.2
  Top Layer w0.508: C7.2 v1(30.99,99.94) 29.4,99.94 C17.1 C20.1 ; v1(34.42,103.37) 33.81,103.99 33.81,105.09 U6.1 ; 29.28,61.72 29.72,61.27 C19.2 30.99,58.6 ; C13.2 v1(30.99,79.88) 29.66,79.88 C11.1 C14.1 ; C6.2 v1(30.86,110.36) 29.52,110.36 C22.1 ; U3.1 34.34,73.98 v1(34.34,72.77) ; U7.1 34.34,114.67 v1(34.34,113.66) ; 30.1,38.42 30.1,37.71 ; 30.99,71.18 v1(30.99,69.59) 29.91,69.59 29.28,70.23 29.28,72 ; v1(34.29,82.67) 34.29,84.33 U4.1 ; v1(34.62,62.4) 33.74,63.29 U2.1 ; C21.1 28.96,110.92 ; C15.1 C16.1 29.91,89.78 v1(30.99,89.78) C12.2 ; U5.1 34.34,94.15 v1(34.34,92.58) ; C32.1 R57.1
  Top Layer w0.762: 37.16,149.54 37.1,149.61 v1(31.36,149.61) C1.2 ; U9.2 70.92,61.21 v1(68.45,61.21) ; 30.03,37.71 CN3.B8 ; v1(70.36,54.99) 71.99,54.99 D1.2
  vias: v1(16.89,62.23) v1(30.99,58.54) v1(71.88,50.92) v1(72.61,75.26) v1(73.58,79.45) v1(74.26,75.28) v1(74.77,79.45)
VBAT_PROT: length 80.6
  Top Layer w0.508: 30.99,65.39 C19.1 ; v1(31.06,85.69) 31.06,82.94 C13.1 ; C6.1 30.9,113.51 U7.15 ; v1(30.99,106.04) C7.1 ; C18.1 31.03,72.62 v1(31.03,75.43) ; v1(31.03,95.6) 31.03,92.56 C12.1
  Top Layer w0.762: 66.84,46.41 60.65,46.41 45.85,61.21 v1(32.64,61.21) ; 66.84,46.41 66.84,46.39 58.87,38.42 CN3.A1 CN3.B1 ; 66.84,46.41 68.01,46.41 R58.2 66.87,46.44 66.84,46.41
  vias: v1(29.97,118.23) v1(29.97,117.22) v1(29.97,116.2) v1(30.05,67.43) v1(30.05,66.41) v1(30.05,65.39) v1(30.1,108.07) v1(30.1,107.06) v1(30.1,106.04) v1(30.14,97.63) v1(30.14,96.61) v1(30.14,95.6) v1(30.14,77.46) v1(30.14,76.44) v1(30.14,75.43) v1(30.18,87.72) v1(30.18,86.71) v1(30.18,85.69) v1(30.86,118.23) v1(30.86,116.2) v1(30.94,67.43) v1(30.94,66.41) v1(30.94,65.39) v1(30.99,108.07) v1(30.99,107.06) v1(31.03,97.63) v1(31.03,96.61) v1(31.03,77.46) v1(31.03,76.44) v1(31.06,87.72) v1(31.06,86.71) v1(31.75,116.2) v1(31.83,67.43) v1(31.83,66.41) v1(31.83,65.39) v1(31.88,108.07) v1(31.88,107.06) v1(31.88,106.04) v1(31.92,97.63) v1(31.92,96.61) v1(31.92,95.6) v1(31.92,77.46) v1(31.92,76.44) v1(31.92,75.43) v1(31.95,87.72) v1(31.95,86.71) v1(31.95,85.69)
BTN1: length 50.5
  Top Layer w0.254: U1.28 57.21,134.3 58.17,133.35 58.17,94.23 61.09,91.31 64.7,91.31 R44.2
BTN2: length 46.4
  Top Layer w0.254: R47.2 64.69,96.52 61.09,96.52 59.06,98.55 59.06,133.47 56.96,135.57 U1.29
BTN3: length 42.3
  Top Layer w0.254: U1.30 56.83,136.84 59.94,133.73 59.94,102.99 61.21,101.72 64.65,101.72 R48.2
BTN4: length 37.7
  Top Layer w0.254: U1.31 56.7,138.11 60.83,133.98 60.83,108.45 62.61,106.68 64.65,106.68 R42.2
BTN5: length 33.5
  Top Layer w0.254: R45.2 64.65,111.88 62.99,111.88 61.72,113.15 61.72,134.23 56.58,139.38 U1.32
BTN6: length 29.3
  Top Layer w0.254: R43.2 63.52,116.94 62.61,117.85 62.61,134.62 56.58,140.65 U1.33
BTN7: length 25.3
  Top Layer w0.254: U1.34 56.58,141.92 63.5,135 63.5,122.3 63.72,122.07 R41.2
BTN8: length 21
  Top Layer w0.254: U1.35 55.03,143.12 56.64,143.12 64.43,135.34 64.43,127.15 64.3,127.15
OUT1: length 80.2
  Top Layer w0.508: 19.05,64.26 19.05,65.4 22.86,65.4 22.86,61.72 C8.2 28.14,61.72 U2.14 U2.13 U2.12 ; CN3.C1 52.96,32.03 52.96,39.11 41.66,50.41 26.42,50.41 15.75,61.08 15.75,63.5 16.51,64.26 19.05,64.26
OUT2: length 70.7
  Top Layer w0.508: CN3.A2 39.97,49.27 26.03,49.27 14.73,60.57 14.73,67.81 15.75,68.83 R29.2 19.05,70.1 27.75,70.1 C10.2 28.14,69.96 U2.9 U2.10
OUT3: length 79.6
  Top Layer w0.508: CN3.A3 37.91,48 25.78,48 13.72,60.07 13.72,73.27 14.61,74.16 R30.2 19.05,75.56 24.89,75.56 24.89,72 27.81,72 27.81,73.53 28.23,73.53 28.23,75.79
OUT4: length 78.9
  Top Layer w0.508: 27.81,80.39 27.81,79.12 28.23,79.12 28.23,77.09 ; R31.2 14.61,79.12 12.7,77.21 12.7,59.56 25.53,46.73 35.81,46.73 44.13,38.42 ; R31.2 19.31,79.12 ; R31.2 19.05,80.39 C11.2
OUT5: length 85.3
  Top Layer w0.508: U4.12 U4.13 U4.14 28.26,83.94 27.69,83.94 27.69,82.16 24.89,82.16 24.89,84.96 19.05,84.96 R32.2 14.35,83.82 11.68,81.15 11.68,59.05 25.15,45.59 33.66,45.59 CN3.A5
OUT6: length 85.7
  Top Layer w0.508: C16.2 19.05,90.55 R33.2 14.61,89.28 10.67,85.34 10.67,58.42 24.64,44.45 31.47,44.45 CN3.A6 ; U4.10 U4.9 28.26,89.21 27.81,89.21 27.81,90.55
OUT7: length 89
  Top Layer w0.508: C15.2 27.81,92.32 27.81,93.59 28.23,94.01 28.23,95.96 ; 19.05,92.58 R34.2 14.6,93.84 9.65,88.9 9.65,57.78 24.13,43.3 29.46,43.3 34.18,38.59 CN3.A7 ; 27.75,92.45 19.05,92.45
OUT8: length 101.6
  Top Layer w0.508: C17.2 23.75,100.71 23.75,97.66 19.05,97.66 R35.2 14.61,99.06 8.64,93.09 8.64,57.15 27.69,38.1 27.69,31.87 29.54,30.02 CN3.C8 ; 28.23,97.26 28.23,99.18 27.31,100.1 27.31,100.71
OUT9: length 118.1
  Top Layer w0.508: 13.84,50.16 26.42,37.59 26.42,29.33 29.34,26.41 30.46,26.41 32.13,28.08 32.13,32.17 CN3.B7 ; 19.05,102.87 C20.2 ; 19.05,102.99 19.05,104.13 18.91,104.28 14.63,104.28 7.62,97.26 7.62,56.38 13.59,50.41 ; 27.31,102.87 27.31,104.39 28.19,104.39 U6.14 U6.13 U6.12
OUT10: length 130.5
  Top Layer w0.508: 19.05,109.34 14.86,109.34 6.66,101.14 v1(6.66,58.29) ; U6.10 U6.9 U6.8 28.19,109.6 27.56,109.6 27.56,110.92 23.75,110.92 23.75,107.95 19.05,107.95 R37.2
  Bottom Layer w0.508: CN3.B6 35.81,32.52 35.81,28.32 33.91,26.41 29.34,26.41 26.42,29.33 26.42,37.59 6.66,57.35 v1(6.66,58.29)
OUT11: length 132.9
  Top Layer w0.508: U7.12 U7.13 U7.14 28.1,114.04 27.56,114.04 C21.2 19.05,112.72 R38.2 14.99,114.04 5.72,104.77 v1(5.72,58.29)
  Bottom Layer w0.508: v1(5.72,58.29) 5.72,56 25.15,36.57 25.15,28.57 28.7,25.01 34.8,25.01 37.5,27.72 CN3.C6
OUT12: length 135.9
  Top Layer w0.508: U7.10 U7.9 U7.8 24.61,119.2 C23.2 24.61,117.47 19.05,117.47 19.05,118.74 ; 19.05,118.74 19.05,118.87 ; 19.05,118.74 14.86,118.74 4.7,108.58 4.7,57.02 25.15,36.57 25.15,28.57 28.7,25.01 33.66,25.01 34.16,25.52 34.16,30 CN3.C7 ; 19.05,118.74 19.18,118.87
PROFET_DEN1: length 75.5
  Top Layer w0.254: U1.23 49.24,129.57 53.72,125.09 53.72,79.24 40.13,65.65 R6.1
PROFET_DEN2: length 65
  Top Layer w0.254: R7.1 40.13,75.56 51.05,86.48 51.05,123.82 45.43,129.45 U1.20
PROFET_DEN3: length 54.2
  Top Layer w0.254: 40.35,131.25 40.35,129.7 48.39,121.66 48.39,94.1 40.13,85.85 R14.1
PROFET_DEN4: length 52
  Top Layer w0.254: 37.16,136.84 35.88,136.84 34.42,135.38 34.42,131.31 45.72,120.01 45.72,101.34 40.13,95.75 R15.1
PROFET_DEN5: length 46.1
  Top Layer w0.254: 37.16,140.65 35.12,140.65 31.75,137.28 31.75,131.31 43.05,120.01 43.05,108.83 40.39,106.17 R22.1
PROFET_DEN6: length 40.1
  Top Layer w0.254: 37.16,144.46 34.35,144.46 29.08,139.19 29.08,131.31 40.39,120.01 40.39,116.45 R23.1
PROFET_DSEL: length 81.9
  Top Layer w0.254: v1(39.5,97.4) R17.1 ; R8.1 v1(39.5,67.31) ; v1(39.5,107.82) R24.1 ; v1(51.82,129.66) 51.82,131.59 U1.25 ; v1(39.5,87.5) R16.1 ; v1(39.5,77.21) R9.1 ; R25.1 v1(39.5,118.11)
  Bottom Layer w0.254: v1(51.82,129.66) 51.82,123.95 45.97,118.11 v1(39.5,118.11) v1(39.5,107.82) v1(39.5,97.4) v1(39.5,87.5) v1(39.5,77.21) v1(39.5,67.31)
PROFET_IN1: length 77.4
  Top Layer w0.254: U1.24 50.51,129.7 54.61,125.6 54.61,78.48 40.13,64 R4.1
PROFET_IN2: length 72
  Top Layer w0.254: R10.1 40.13,68.96 52.83,81.66 52.83,124.71 47.97,129.57 U1.22
PROFET_IN3: length 66.8
  Top Layer w0.254: U1.21 46.7,129.57 51.94,124.33 51.94,85.72 40.13,73.91 R5.1
PROFET_IN4: length 61.5
  Top Layer w0.254: R11.1 40.13,78.86 50.16,88.9 50.16,123.31 44.16,129.32 U1.19
PROFET_IN5: length 55.9
  Top Layer w0.254: R12.1 40.13,84.2 49.28,93.34 49.28,122.8 42.89,129.19 U1.18
PROFET_IN6: length 51
  Top Layer w0.254: 39.08,131.5 39.08,129.19 47.5,120.77 47.5,96.39 40.26,89.15 R18.1
PROFET_IN7: length 52.3
  Top Layer w0.254: 37.16,135.57 36.01,135.57 35.31,134.87 35.31,131.25 46.61,119.95 46.61,100.58 40.13,94.1 R13.1
PROFET_IN8: length 50.4
  Top Layer w0.254: R19.1 38.22,98.93 40.26,98.93 44.83,103.5 44.83,120.01 33.53,131.31 33.53,136.01 35.62,138.11 37.16,138.11
PROFET_IN9: length 46.3
  Top Layer w0.254: 37.16,139.38 35.37,139.38 32.64,136.65 32.64,131.31 43.94,120.01 43.94,108.2 40.26,104.52 R20.1
PROFET_IN10: length 44.2
  Top Layer w0.254: R26.1 40.39,109.47 42.16,111.25 42.16,120.01 30.86,131.31 30.86,137.92 34.86,141.92 37.16,141.92
PROFET_IN11: length 40.3
  Top Layer w0.254: R21.1 40.26,114.8 41.28,115.82 41.28,120.01 29.97,131.31 29.97,138.55 34.61,143.19 37.16,143.19
PROFET_IN12: length 35.6
  Top Layer w0.254: R27.1 37.97,119.76 37.97,121.53 28.19,131.31 28.19,139.95 33.97,145.73 37.16,145.73
PROFET_IS: length 82.7
  Top Layer w0.254: v1(35.25,117.22) 33.73,117.22 U7.4 ; U6.4 v1(35.31,107.06) ; U4.4 v1(35.31,86.71) ; U5.4 v1(35.31,96.61) ; v1(23.62,125.09) R3.2 20.69,126.45 C4.2 20.63,126.65 R2.2 ; U2.4 v1(35.31,66.41) ; U3.4 v1(35.31,76.44)
  Bottom Layer w0.254: v1(23.62,125.09) 26.92,125.09 31.44,120.57 35.25,120.57 v1(35.25,117.22) 35.31,117.16 v1(35.31,107.06) v1(35.31,96.61) v1(35.31,86.71) v1(35.31,76.44) v1(35.31,66.41)
UART_RX: length 11.9
  Top Layer w0.254: U1.36 v1(56.79,144.46)
  Bottom Layer w0.254: 66.06,142.68 66,142.62 64.13,142.62 62.29,144.46 v1(56.79,144.46)
UART_TX: length 11.4
  Top Layer w0.254: U1.37 v1(56.79,145.73)
  Bottom Layer w0.254: 66.06,145.22 65.59,145.22 65.09,145.73 56.67,145.73
VSENSE_BAT: length 125.2
  Top Layer w0.254: U1.39 59.06,148.27 C5.2 67,148.26 68.96,146.3 68.96,132.71 70.36,131.31 73.53,131.31 75.18,129.66 75.18,86.86 70.36,86.86 65.91,82.42 65.91,53.39 68.05,51.26
  Top Layer w0.762: R58.1 68.05,47.95 68.05,51.26
$1N12: length 23.1
  Top Layer w0.254: R2.1 20.66,129.54 v1(23.62,129.54) ; U1.17 v1(41.62,129.54)
  Bottom Layer w0.254: v1(41.62,129.54) v1(23.62,129.54)
$1N15: length 46.2
  Top Layer w0.254: R1.2 26.54,145.92 27.56,146.93 28.92,146.93 C3.2 37.14,146.97 37.16,147 v1(44.58,147) ; SW1.2 70.76,147.04
  Bottom Layer w0.254: v1(70.64,147.04) 70.6,147 v1(44.58,147)
$1N16: length 17.1
  Top Layer w0.254: v1(56.77,133.16) 55.09,133.16 U1.27 ; SW2.1 v1(70.74,133.04)
  Bottom Layer w0.254: v1(56.77,133.16) 70.62,133.16 v1(70.74,133.04)
$1N105: length 3.3
  Top Layer w0.254: R4.2 35.48,65.11 U2.2
$1N106: length 2.9
  Top Layer w0.254: U2.3 33.84,65.65 R6.2
$1N107: length 2.9
  Top Layer w0.254: R8.2 36.34,67.06 U2.5
$1N108: length 3.4
  Top Layer w0.254: U2.6 35.34,67.71 R10.2
$1N109: length 3.2
  Top Layer w0.254: U4.2 35.38,85.41 R12.2
$1N110: length 2.8
  Top Layer w0.254: U4.3 36.38,86.06 R14.2
$1N111: length 2.8
  Top Layer w0.254: U4.5 36.44,87.36 R16.2
$1N112: length 3.2
  Top Layer w0.254: R18.2 35.44,88.01 U4.6
$1N113: length 3.2
  Top Layer w0.254: U6.2 35.22,105.76 R20.2
$1N114: length 2.8
  Top Layer w0.254: U6.3 36.22,106.41 R22.2
$1N115: length 2.7
  Top Layer w0.254: R24.2 36.35,107.71 U6.5
$1N116: length 3.1
  Top Layer w0.254: R26.2 35.34,108.36 U6.6
$1N117: length 3.3
  Top Layer w0.254: R5.2 35.35,75.14 U3.2
$1N118: length 2.9
  Top Layer w0.254: R7.2 36.35,75.79 U3.3
$1N119: length 2.8
  Top Layer w0.254: U3.5 36.47,77.09 R9.2
$1N120: length 3.2
  Top Layer w0.254: U3.6 35.47,77.74 R11.2
$1N121: length 3.3
  Top Layer w0.254: R13.2 35.38,95.31 U5.2
$1N122: length 2.8
  Top Layer w0.254: U5.3 36.38,95.96 R15.2
$1N123: length 2.8
  Top Layer w0.254: U5.5 36.44,97.26 R17.2
$1N124: length 3.2
  Top Layer w0.254: R19.2 35.44,97.91 U5.6
$1N125: length 3.2
  Top Layer w0.254: U7.2 35.31,115.95 R21.2
$1N126: length 2.8
  Top Layer w0.254: U7.3 36.31,116.6 R23.2
$1N127: length 2.8
  Top Layer w0.254: U7.5 36.25,117.9 R25.2
$1N128: length 3.3
  Top Layer w0.254: R27.2 35.25,118.55 U7.6
$1N191: length 2
  Top Layer w0.254: LED1.1 20.56,62.23 20.56,64.26
$1N192: length 2
  Top Layer w0.254: LED2.1 20.56,66.8 R29.1
$1N193: length 2
  Top Layer w0.254: R30.1 20.56,72.13 LED3.1
$1N194: length 2
  Top Layer w0.254: LED4.1 20.56,77.08 R31.1
$1N195: length 2
  Top Layer w0.254: LED5.1 20.56,81.78 R32.1
$1N196: length 2
  Top Layer w0.254: LED6.1 20.56,87.24 R33.1
$1N197: length 1.9
  Top Layer w0.254: R34.1 20.56,95.75 LED7.1
$1N198: length 1.9
  Top Layer w0.254: LED8.1 20.56,100.96 R35.1
$1N199: length 1.9
  Top Layer w0.254: R36.1 20.56,106.17 LED9.1
$1N200: length 1.9
  Top Layer w0.254: LED10.1 20.56,111.25 R37.1
$1N201: length 1.9
  Top Layer w0.254: R38.1 20.56,115.95 LED11.1
$1N202: length 1.9
  Top Layer w0.254: R39.1 20.56,120.77 LED12.1
$1N205: length 2.2
  Top Layer w0.762: R40.1 73.12,69.3 LED13.1
$1N232: length 111.4
  Top Layer w0.254: 66.06,127.1 R49.1 69.51,127.09 C27.1 ; 66.06,127.1 R46.1 ; 66.06,127.1 66.06,125.62 v1(65.15,124.71)
  Bottom Layer w0.254: CN3.B5 40.84,34.23 42.42,35.81 42.42,39.62 58.17,55.37 58.17,120.77 62.1,124.71 v1(65.15,124.71)
$1N234: length 96.2
  Top Layer w0.254: C28.1 72.31,91.42 69.5,91.42 69.41,91.32 R44.1 66.21,89.96 v1(65.15,88.9)
  Bottom Layer w0.254: v1(65.15,88.9) 64.4,88.14 64.4,46.11 60.32,42.03 60.32,28.7 56.39,24.76 43.43,24.76 40.84,27.36 CN3.C5
$1N241: length 96.4
  Top Layer w0.254: C26.1 69.51,106.77 R56.1 66.27,106.78 R42.1 66.19,104.79 v1(65.15,103.75)
  Bottom Layer w0.254: v1(65.15,103.75) 61.72,100.33 61.72,48.51 57.66,44.45 57.66,29.71 55.63,27.68 51.44,27.68 50.82,28.29 CN3.C2
$1N243: length 90.4
  Top Layer w0.254: v1(65.15,108.96) 66.19,110 R45.1 66.24,111.86 R52.1 72.35,111.86 C25.1
  Bottom Layer w0.254: v1(65.15,108.96) 60.83,104.64 60.83,49.4 52.71,41.27 52.71,35.81 51.11,34.22 CN3.B2
$1N245: length 96.7
  Top Layer w0.254: C24.1 69.53,116.91 R54.1 R43.1 66.09,114.98 v1(65.15,114.04)
  Bottom Layer w0.254: CN3.B3 49.28,36 49.28,39.75 59.94,50.41 59.94,108.83 v1(65.15,114.04)
$1N268: length 103.2
  Top Layer w0.254: C29.1 72.24,122.02 R55.1 69.5,122.07 R41.1 66.06,120.03 v1(65.15,119.12)
  Bottom Layer w0.254: CN3.B4 45.85,35.9 45.85,39.49 59.06,52.7 59.06,113.03 v1(65.15,119.12)
$1N277: length 96.6
  Top Layer w0.254: v1(65.15,98.67) 66.19,99.71 R48.1 66.24,101.7 R53.1 69.51,101.69 72.42,101.69
  Bottom Layer w0.254: v1(65.15,98.67) 62.61,96.13 62.61,47.62 58.55,43.56 58.55,29.33 55.75,26.54 49.02,26.54 47.5,28.06 47.5,30.01 CN3.C3
$1N278: length 96.2
  Top Layer w0.254: v1(65.15,93.72) 66.21,94.78 R47.1 66.23,96.48 R51.1 69.58,96.61 72.42,96.61
  Bottom Layer w0.254: CN3.C4 44.2,29.98 44.2,27.94 46.48,25.65 56.01,25.65 59.44,29.08 59.44,42.79 63.5,46.86 63.5,92.07 v1(65.15,93.72)

## Copper pours and planes (outline as drawn; the poured copper is in the pictures)
GND on Top Layer: 71.75,82.75 75.41,82.75 75.41,70.35 71.75,70.35
GND on Bottom Layer: -0.25,162.56 85.38,162.56 85.38,22.3 -0.25,22.3
GND on GND: 0.26,162.43 84.74,162.43 84.74,22.94 0.26,22.94
VBAT_PROT on Top Layer: 64.33,66.67 79.25,66.67 79.25,44.32 64.33,44.32
VBAT_PROT on Bottom Layer: 29.59,119.25 32.89,119.25 32.89,60.83 29.59,60.83
VBAT_PROT on +12V: 0.26,162.43 84.74,162.43 84.74,22.94 0.26,22.94
$1N257 on Top Layer: 75.66,82.75 78.84,82.75 78.84,69.04 75.66,69.04

Small or netless copper shapes (teardrops, artwork), in the pictures only: 16 on GND, 8 on +12V

## Text on the board
Top Silkscreen Layer: Not rated for competent installation | 24W Connector: HCCPHPE24BKA90F / Mating Connector: 211PC249S0033 / Connector Pins: / -1.5mm 18x 211CC2S2120 / -2.8mm 6x 211CC3S2120 | TX | RX | +12V | RESET | BOOT | Moto-Ctrl v1.0 | OUT 10 | OUT 9 | OUT 8 | OUT 4 | OUT 7 | OUT 1 | OUT 2 | OUT 3 | IN 1 | IN 5 | IN 3 | IN 7 | IN 2 | IN 6 | IN 4 | IN 8 | OUT 12 | OUT 11 | OUT 5 | OUT 6
